# Altium schematic sheet PSU.SchDoc
size A4; SheetNumber: 5; SheetTotal: 7
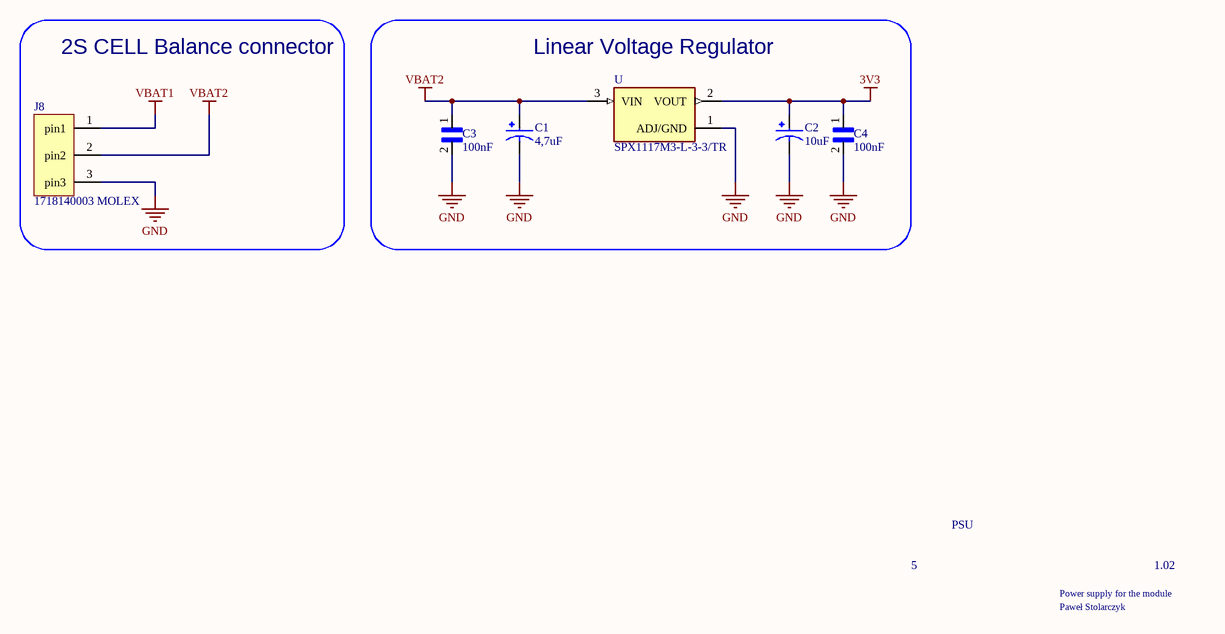
[diagram p0: PSU.SchDoc]

## Parts
C1  4,7uF  [CAP_EEE1CA100SR]
C2  10uF  [CAP_EEE1CA100SR]
C3  100nF  [CAPC1608X90N]
C4  100nF  [CAPC1608X90N]
J8  1718140003 MOLEX  [3pinangled]
U  SPX1117M3-L-3-3/TR  [SOT230P700X180-3N]

## Blocks framed on the sheet
2S CELL Balance connector: J8
Linear Voltage Regulator: C1-C4 U

## Nets
3V3: C2.1 C4.1 U.2(VOUT)
GND: C1.2 C2.2 C3.2 C4.2 J8.3(pin3) U.1(ADJ/GND)
VBAT1: J8.1(pin1)
VBAT2: C1.1 C3.1 J8.2(pin2) U.3(VIN)

## Notes on the sheet
- PSU
- 5
- Power supply for the module
- 1.02
- Paweł Stolarczyk

## Library data of the parts
C1 C2 = EEE1CA100SR: 10ÂµF 16V Aluminum Electrolytic Capacitors Radial, Can - SMD 2000 Hrs @ 85Â°C; MF: Panasonic; Digi-Key_Part_Number: PCE3878CT-ND; Check_prices: https://www.snapeda.com/parts/EEE1CA100SR/Panasonic/view-part/?ref=eda; Value: *; MP: EEE1CA100SR; Package: RADIAL-2 Panasonic; SnapEDA_Link: https://www.snapeda.com/parts/EEE1CA100SR/Panasonic/view-part/?ref=snap
C3 C4 = C0603C104J4RAC: 0.1ÂµF Â±5% 16V Ceramic Capacitor X7R 0603 (1608 Metric); MF: KEMET; MP: C0603C104J4RAC; SnapEDA_Link: https://www.snapeda.com/parts/C0603C104J4RAC/KEMET/view-part/1763758/?ref=snap; Availability: Warning; Package: 0603 KEMET; Check_prices: https://www.snapeda.com/parts/C0603C104J4RAC/KEMET/view-part/1763758/?ref=eda; Value: *; Price: None
J8 = 3pinangled
U = SPX1117M3-L-3-3/TR: Linear Voltage Regulator IC Positive Fixed 1 Output 800mA SOT-223; MF: MaxLinear, Inc.; Value: *; SnapEDA_Link: https://www.snapeda.com/parts/SPX1117M3-L-3-3/TR/MaxLinear%2C%20Inc./view-part/376705/?ref=snap; Package: SOT-223 Exar; MP: SPX1117M3-L-3-3/TR; Price: None; Availability: Unavailable